# Altium schematic sheet ARM_SERVO.SchDoc: Title
size A4; Date: *******; ApprovedBy: *******; CheckedBy: None; Author: *******; CompanyName: *******; DrawnBy: Jacob Chisholm; Engineer: *******; Organization: *******; Address1: *******; Address2: *******; Address3: *******; Address4: *******; DocumentNumber: 6; Revision: *******; SheetNumber: 6; SheetTotal: 9; Address_Website: https://jchisholm204.github.io; E-Mail: JacobChisholm1010@gmail.com; CurrentTime: *******; CurrentDate: *******; Time: *******; DocumentFullPathAndName: *******; DocumentName: *******; ModifiedDate: *******; ImagePath: *******; ProjectName: *******; Application_BuildNumber: *******
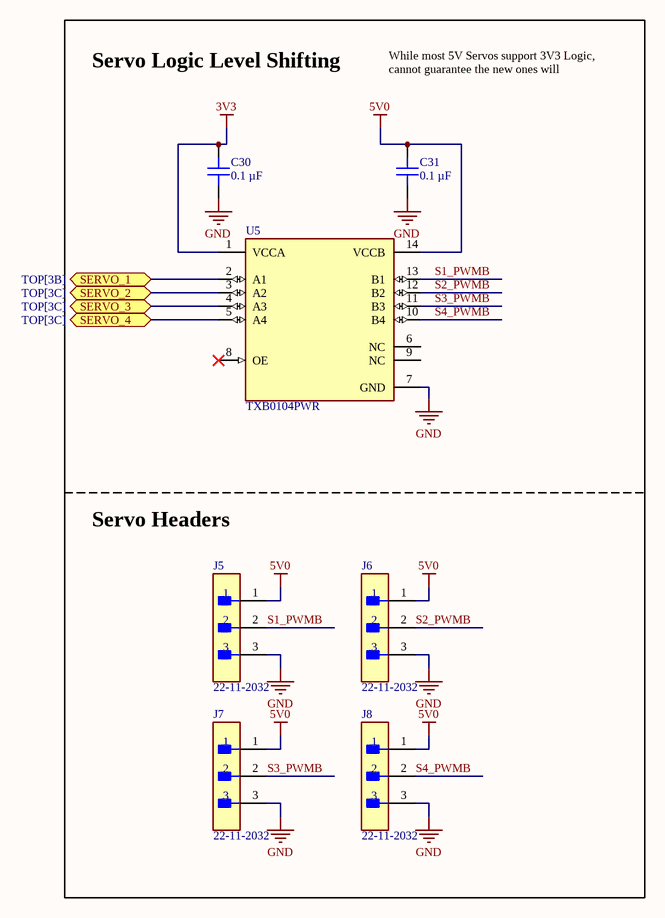
[diagram p0: ARM_SERVO.SchDoc]

## Parts
C30  0.1 µF  [CAP 0603_1608]
C31  0.1 µF  [CAP 0603_1608]
J5  22-11-2032  [FP-22-11-2032-MFG]
J6  22-11-2032  [FP-22-11-2032-MFG]
J7  22-11-2032  [FP-22-11-2032-MFG]
J8  22-11-2032  [FP-22-11-2032-MFG]
U5  TXB0104PWR  [Texas_Instruments_PW0014A_MFG]

## Ports
SERVO_1 (bidir, see TOP[3B]), SERVO_2 (bidir, see TOP[3C]), SERVO_3 (bidir, see TOP[3C]), SERVO_4 (bidir, see TOP[3C])

## Nets
3V3: C30.2 U5.1(VCCA)
5V0: C31.2 J5.1 J6.1 J7.1 J8.1 U5.14(VCCB)
GND: C30.1 C31.1 J5.3 J6.3 J7.3 J8.3 U5.7(GND)
S1_PWMB: J5.2 U5.13(B1)
S2_PWMB: J6.2 U5.12(B2)
S3_PWMB: J7.2 U5.11(B3)
S4_PWMB: J8.2 U5.10(B4)
SERVO_1: U5.2(A1) ; port SERVO_1
SERVO_2: U5.3(A2) ; port SERVO_2
SERVO_3: U5.4(A3) ; port SERVO_3
SERVO_4: U5.5(A4) ; port SERVO_4

Not connected (* = marked no-connect by the designer): U5 6(NC) 8(OE)* 9(NC)

## Notes on the sheet
- Servo Logic Level Shifting
- While most 5V Servos support 3V3 Logic, cannot guarantee the new ones will
- Servo Headers
- Title:
- Drawn By:
- Page Contents:
- Checked By:
- Size:
- Date:
- File:
- License:
- Email:
- A4
- Number:
- Time:
- Revision:
- Sheet
- Website:
- of

## Library data of the parts
C30 C31 = GMC10X7R104K25NT: CAP0603 X7R .1UF 10% 25V; manufacturer: Cal-Chip Electronics, Inc.; Part Number: GMC10X7R104K25NT; Value: 0.1 µF; Applications: General Purpose; Capacitance: 0.1 µF; componentlink1description: Datasheet; componentlink1url: https://88ce57.p3cdn1.secureserver.net/wp-content/uploads/2023/01/gmc_series-2.pdf; componentlink2description: DigiKey Link; componentlink2url: https://www.digikey.com/en/products/detail/cal-chip-electronics-inc/GMC10X7R104K25NT/19910724; Device Package: 0603 (1608 Metric); lastupdated: 2/9/2024 8:08:39 PM; Lifecycle Status: Active; Minimum Order: 1; Mounting Type: Surface Mount, MLCC; Operating Temperature: -55°C ~ 125°C; Package / Case: 0603 (1608 Metric); packaging: TapeAndReel; partid: 56631; price: 0.01; series: GMC; Size / Dimension: 0.063" L x 0.031" W (1.60mm x 0.80mm); Supplier 1: DigiKey; Supplier Part Number 1: 4713-GMC10X7R104K25NTCT-ND; Temperature Coefficient: X7R; Thickness (Max): 0.035" (0.90mm); Tolerance: ±10%; Voltage - Rated: 25V
J5-J8 = CMP-04776-000113-1: CONN HEADER VERT 3POS 2.54MM; Manufacturer: Molex; Number Of Contacts: 3; Voltage Rating: 500V; Conn Gender: Male; Current Rating: 4A; Conn Orientation: Vertical; Device Class L2: Headers and Wire Housings; Number Of Rows: 1; Temperature Range High: +80°C; RoHS: TRUE; ComponentLink2URL: https://www.molex.com/webdocs/datasheets/pdf/en-us/0022112032_PCB_HEADERS.pdf; Manufacturer Part Number: 22-11-2032; Device Class L3: unset; Automotive: No; Temperature: -40°C to +80°C; Temperature Range Low: -40°C; Lead Free: Yes; Pitch: 2.54mm; Footprint Url: https://www.molex.com/pdm_docs/sd/022112032_sd.pdf; Digikey Description: CONN HEADER VERT 3POS 2.54MM; Contact Material: Gold,Nickel; Octopart: https://octopart.com/22-11-2032-molex-10085; Height: 10.91mm; Mouser Description: KK® 254 Solid Header, Vertical, with Friction Lock, 3 Circuits, Gold (Au) Plating; Package: 22-11-2032; Device Class L1: Connectors; Mounting Type: Through Hole; ComponentLink2Description: Datasheet; Category: Conn
U5 = CMP-2000-07335-2: NexarPartId: 1486292; Manufacturer Lifecycle Status: ACTIVE; Quiescent Current: 3.5µA; Number of Circuits: 1; Logic Function: Translator; Number of Bits: 4; Max Supply Voltage: 5.5V; Low Level Output Current: 20µA; Data Rate: 100Mbps; Nominal Supply Current: 5µA; Turn-On Delay Time: 31ns; Propagation Delay: 4ns; High Level Output Current: -20µA; Min Supply Voltage: 1.2V; Rise Time: 700ps; Max Junction Temperature (Tj): 150°C; Number of Outputs: 4; Ambient Temperature Range High: 85°C; Width: 4.4mm; Height: 1.2mm; Radiation Hardening: No; Case/Package: TSSOP; Number of Inputs: 4; Packaging: Digi-Reel®; RoHS: Compliant; Weight: 57.209338mg; Length: 5mm; REACH SVHC: No SVHC; Min Supply Voltage (DC): 1.2V; Min Operating Temperature: -40°C; Number of Channels: 4; Number of Pins: 14; Schedule B: 8542390000, 8542390000; Max Operating Temperature: 85°C; Output Current: 20µA; Thickness: 1mm; Lead Free: Lead Free; Lifecycle Status: Production; Mount: Surface Mount